# Altium schematic sheet cs301_11.SchDoc
size A4
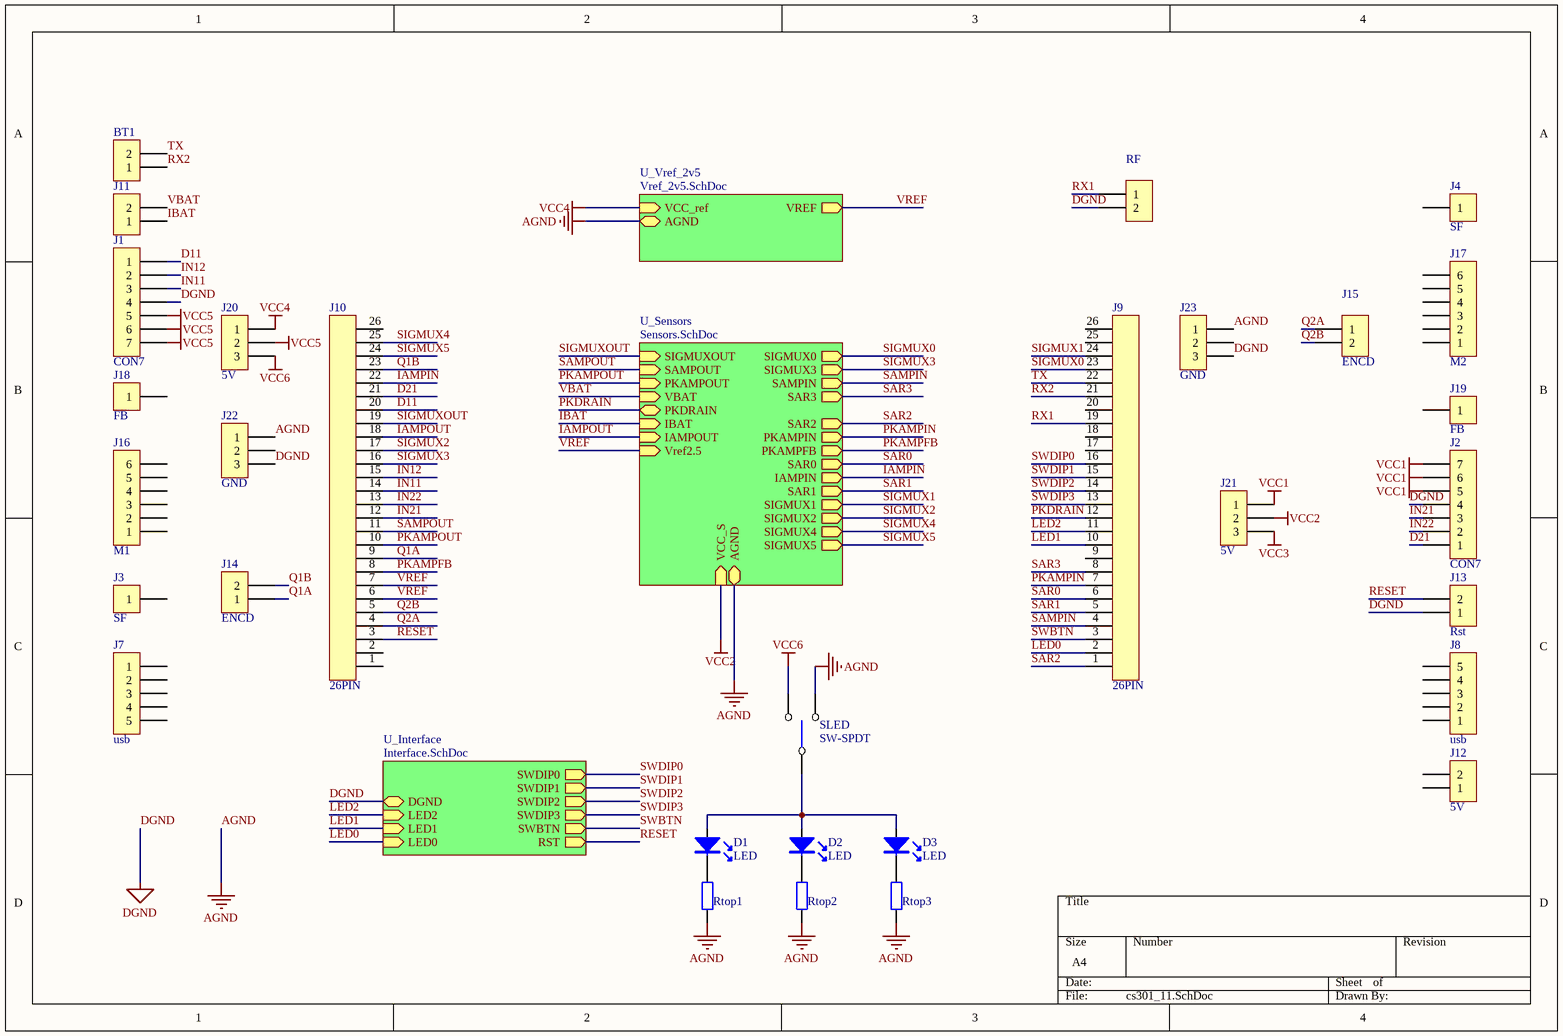
[diagram p0: cs301_11.SchDoc]

## Parts
BT1  Battery  [sip2]  (value not drawn)
D1  LED  [LED0.1/5MM]
D2  LED  [LED0.1/5MM]
D3  LED  [LED0.1/5MM]
J1  CON7  [SIP7]
J2  CON7  [SIP7]
J3  SF  [SIP1/0.6]
J4  SF  [SIP1/0.6]
J7  usb  [SIP5]
J8  usb  [SIP5]
J9  26PIN  [SIP26]
J10  26PIN  [SIP26]
J11  Battery  [sip2]  (value not drawn)
J12  5V  [sip2]
J13  Rst  [sip2]
J14  ENCD  [sip2]
J15  ENCD  [sip2]
J16  M1  [sip6]
J17  M2  [sip6]
J18  FB  [SIP1/0.6]
J19  FB  [SIP1/0.6]
J20  5V  [sip3]
J21  5V  [sip3]
J22  GND  [sip3]
J23  GND  [sip3]
RF  (no value)  [sip2]
Rtop1  270R  [ECE-RESC1608-0603SM]  (value not drawn)
Rtop2  270R  [ECE-RESC1608-0603SM]  (value not drawn)
Rtop3  270R  [ECE-RESC2012-0805SM]  (value not drawn)
SLED  SW-SPDT  [SW-SPDT]

## Sub-sheets
U_Interface = Interface.SchDoc: SWDIP0 (out), SWDIP1 (out), SWDIP2 (out), SWDIP3 (out), SWBTN (out), DGND (bidir), LED2 (in), LED1 (in), LED0 (in), RST (out)
U_Sensors = Sensors.SchDoc: SIGMUX0 (out), SIGMUX3 (out), SIGMUXOUT (in), SAMPIN (out), SAR3 (out), Vref2.5 (in), SAMPOUT (in), SAR2 (out), PKAMPIN (out), PKAMPOUT (in), PKAMPFB (out), VBAT (in), SAR0 (out), PKDRAIN (bidir), IBAT (in), IAMPIN (out), IAMPOUT (in), SAR1 (out), SIGMUX1 (out), SIGMUX2 (out), SIGMUX4 (out), SIGMUX5 (out), VCC_S (in), AGND (bidir)
U_Vref_2v5 = Vref_2v5.SchDoc: VREF (out), VCC_ref (in), AGND (bidir)

## Nets
AGND: J22.1 J23.1 Rtop1.1 Rtop2.1 Rtop3.1 SLED.3 ; sheet U_Sensors/AGND, sheet U_Vref_2v5/AGND
DGND: J1.4 J2.4 J13.1 J22.3 J23.3 RF.2 ; sheet U_Interface/DGND
VCC1: J2.5 J2.6 J2.7 J21.1
VCC2: J21.2 ; sheet U_Sensors/VCC_S
VCC3: J21.3
VCC4: J20.1 ; sheet U_Vref_2v5/VCC_ref
VCC5: J1.5 J1.6 J1.7 J20.2
VCC6: J20.3 SLED.1
D11: J1.1 J10.20
D21: J2.1 J10.21
IAMPIN: J10.22 ; sheet U_Sensors/IAMPIN
IAMPOUT: J10.18 ; sheet U_Sensors/IAMPOUT
IBAT: J11.1 ; sheet U_Sensors/IBAT
IN11: J1.3 J10.14
IN12: J1.2 J10.15
IN21: J2.3 J10.12
IN22: J2.2 J10.13
LED0: J9.2 ; sheet U_Interface/LED0
LED1: J9.10 ; sheet U_Interface/LED1
LED2: J9.11 ; sheet U_Interface/LED2
PKAMPFB: J10.8 ; sheet U_Sensors/PKAMPFB
PKAMPIN: J9.7 ; sheet U_Sensors/PKAMPIN
PKAMPOUT: J10.10 ; sheet U_Sensors/PKAMPOUT
PKDRAIN: J9.12 ; sheet U_Sensors/PKDRAIN
Q1A: J10.9 J14.1
Q1B: J10.23 J14.2
Q2A: J10.4 J15.1
Q2B: J10.5 J15.2
RESET: J10.3 J13.2 ; sheet U_Interface/RST
RX1: J9.19 RF.1
RX2: BT1.1 J9.21
SAMPIN: J9.4 ; sheet U_Sensors/SAMPIN
SAMPOUT: J10.11 ; sheet U_Sensors/SAMPOUT
SAR0: J9.6 ; sheet U_Sensors/SAR0
SAR1: J9.5 ; sheet U_Sensors/SAR1
SAR2: J9.1 ; sheet U_Sensors/SAR2
SAR3: J9.8 ; sheet U_Sensors/SAR3
SIGMUX0: J9.23 ; sheet U_Sensors/SIGMUX0
SIGMUX1: J9.24 ; sheet U_Sensors/SIGMUX1
SIGMUX2: J10.17 ; sheet U_Sensors/SIGMUX2
SIGMUX3: J10.16 ; sheet U_Sensors/SIGMUX3
SIGMUX4: J10.25 ; sheet U_Sensors/SIGMUX4
SIGMUX5: J10.24 ; sheet U_Sensors/SIGMUX5
SIGMUXOUT: J10.19 ; sheet U_Sensors/SIGMUXOUT
SWBTN: J9.3 ; sheet U_Interface/SWBTN
SWDIP0: J9.16 ; sheet U_Interface/SWDIP0
SWDIP1: J9.15 ; sheet U_Interface/SWDIP1
SWDIP2: J9.14 ; sheet U_Interface/SWDIP2
SWDIP3: J9.13 ; sheet U_Interface/SWDIP3
TX: BT1.2 J9.22
VBAT: J11.2 ; sheet U_Sensors/VBAT
VREF: J10.6 J10.7 ; sheet U_Sensors/Vref2.5, sheet U_Vref_2v5/VREF
NetD1_A: D1.A D2.A D3.A SLED.2
NetD1_K: D1.K Rtop1.2
NetD2_K: D2.K Rtop2.2
NetD3_K: D3.K Rtop3.2

Not connected (* = marked no-connect by the designer): J3 1; J4 1; J7 1 2 3 4 5; J8 1 2 3 4 5; J9 9 17 18 20 25 26; J10 1 2 26; J12 1 2; J16 1 2 3 4 5 6; J17 1 2 3 4 5 6; J18 1; J19 1; J22 2; J23 2

## Library data of the parts
BT1 J11-J15 RF = CON2: Connector
J1 J2 = CON7: Connector
J3 J4 J18 J19 = CON1: Connector
J7 J8 = CON5: Connector
J16 J17 = CON6: Connector
J20-J23 = CON3: Connector
Rtop1 Rtop2 = RES000131: RES CER 270R 1608 SM; Assembly Method: Surface Mount; Voltage/Current: 1/10W; Item Type: Item; Path: ece/ts/Lists/Stock Inventory; Value: 270R; UoA Stock#: RES000131; Size/Package: 1608 (0603); Component Type: RES-1608-270R; Category: Resistor; Status: Active
Rtop3 = RES000531: RES CER 270R 2012 SM; Assembly Method: Surface Mount; Voltage/Current: 1/8W; Item Type: Item; Path: ece/ts/Lists/Stock Inventory; Value: 270R; UoA Stock#: RES000531; Size/Package: 2012 (0805); Component Type: RES-2012-270R; Category: Resistor; Status: Active
SLED = SW-SPDT: Toggle Switch